# Altium schematic sheet sensors.SchDoc
size A4; Organization: Arribada Initiative; Address1: https://github.com/arribada; Address2: contact@arribada.org; Address3: arribada.org; Address4: UK - Portsmouth; DocumentNumber: 7; SheetNumber: 7; SheetTotal: 13
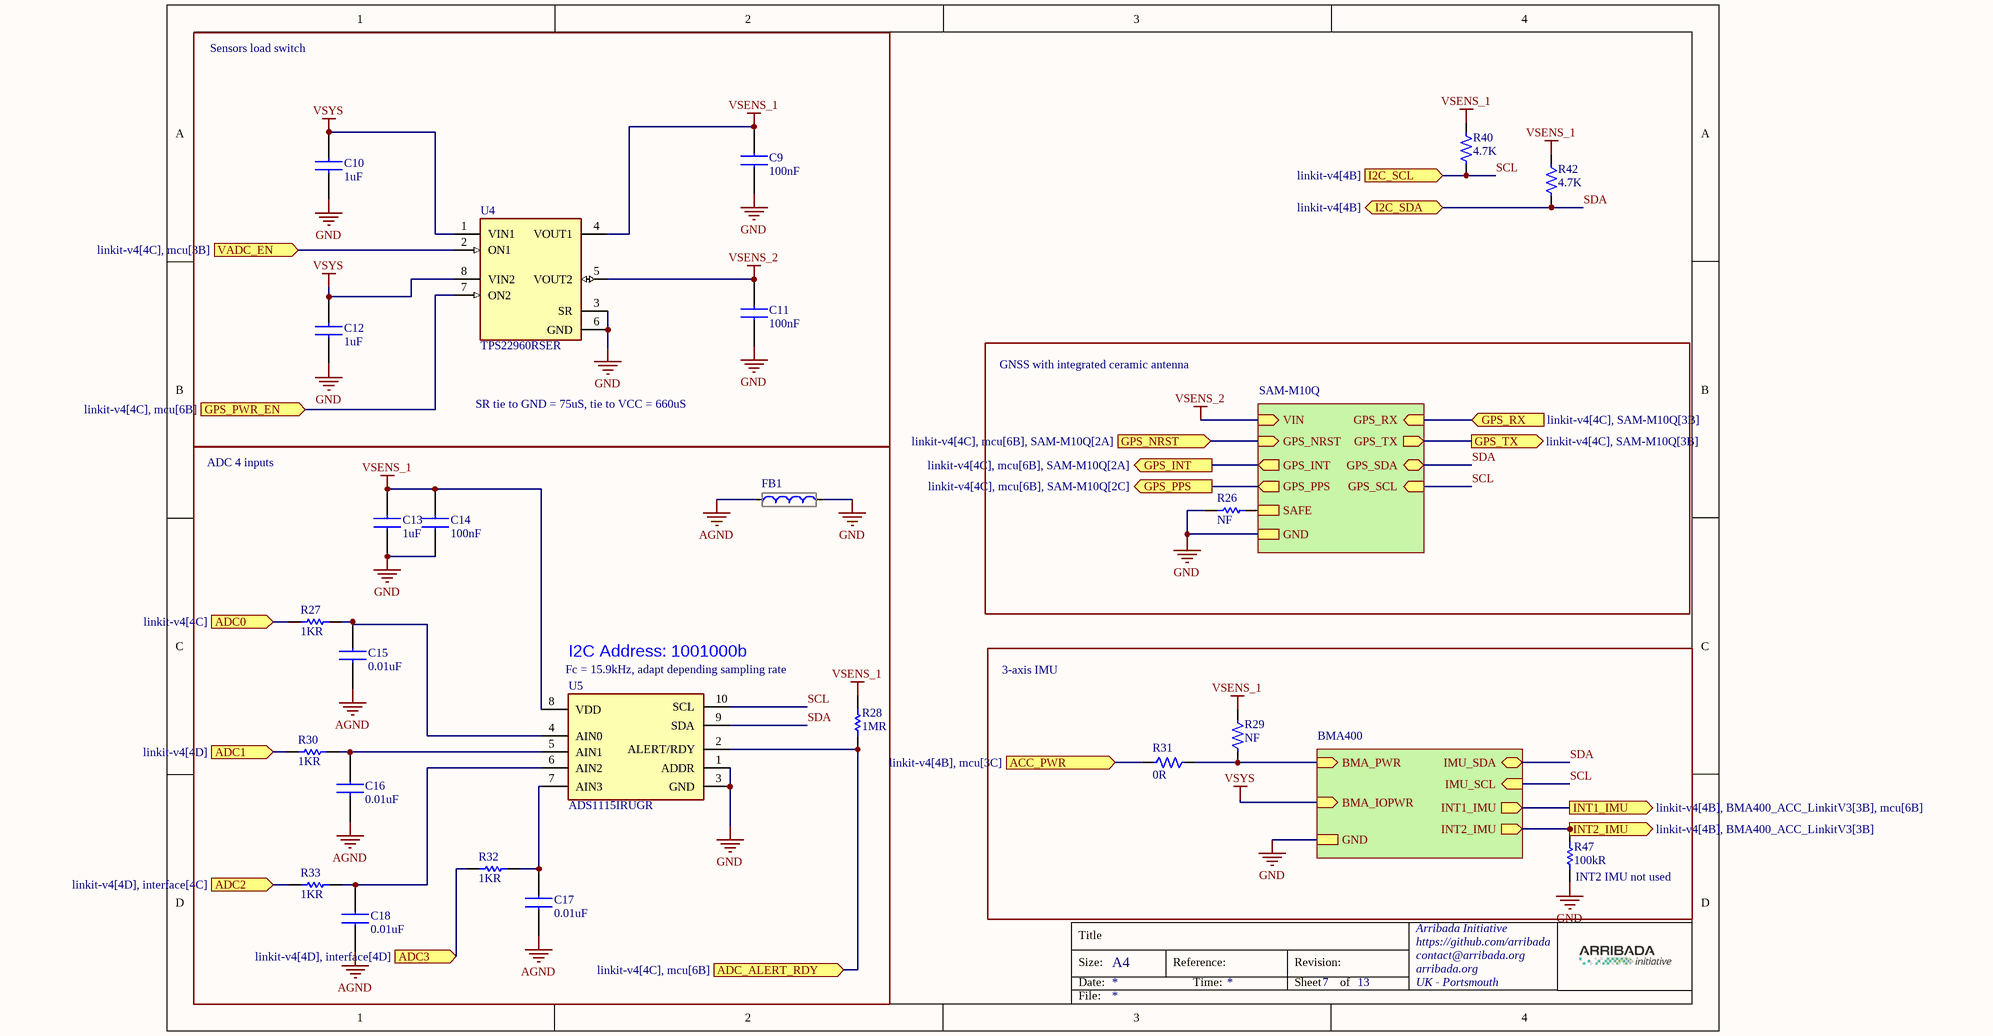
[diagram p0: sensors.SchDoc]

## Parts
C9  value 100nF  [0402]  (hidden comment: GRM155R71C104KA88D)
C10  1uF  [CAPC1005X55N]
C11  value 100nF  [0402]  (hidden comment: GRM155R71C104KA88D)
C12  1uF  [CAPC1005X55N]
C13  1uF  [CAPC1005X55N]
C14  value 100nF  [0402]  (hidden comment: GRM155R71C104KA88D)
C15  value 0.01uF  [GRM15x]  (hidden comment: GRM1555CYA103GE01D)
C16  value 0.01uF  [GRM15x]  (hidden comment: GRM1555CYA103GE01D)
C17  value 0.01uF  [GRM15x]  (hidden comment: GRM1555CYA103GE01D)
C18  value 0.01uF  [GRM15x]  (hidden comment: GRM1555CYA103GE01D)
FB1  BLM18HE601SN1D  [BLM18SP221SN1B]  (value not drawn)
R26  value NF  [R0402]  (hidden comment: Resistor)
R27  1kR  [RESC0603X28N]
R28  value 1MR  [RESC0603X26N]  (hidden comment: RC0201FR-7D1ML)
R29  value NF  [RES0402N_NF]  (hidden comment: RES NF 0402)
R30  1kR  [RESC0603X28N]
R31  value 0R  [RES0402N]  (hidden comment: 0R 0402)
R32  1kR  [RESC0603X28N]
R33  1kR  [RESC0603X28N]
R40  value 4.7K  [RES0201L]  (hidden comment: 4.7K 0201 1% 100PPM)
R42  value 4.7K  [RES0201L]  (hidden comment: 4.7K 0201 1% 100PPM)
R47  value 100kR  [RESC0603X28N]  (hidden comment: CRCW0201100KJNED)
U4  TPS22960RSER  [TPS22960RSER]
U5  ADS1115IRUGR  [ADS1115IRUGR]

## Blocks framed on the sheet
GNSS with integrated ceramic antenna: R26
I2C Address: 1001000b: C13-C18 FB1 R27 R28 R30 R32 R33 U5

## Sub-sheets
BMA400 = BMA400_ACC_LinkitV3: INT1_IMU (out), INT2_IMU (out), BMA_PWR (in), IMU_SDA (bidir), IMU_SCL (in), GND, BMA_IOPWR (in)
SAM-M10Q = SAM-M10Q: GPS_NRST (in), GPS_INT (out), GPS_SDA (bidir), GPS_PPS (out), VIN (in), GPS_TX (out), GPS_SCL (in), GPS_RX (in), GND, SAFE

## Ports
ACC_PWR (in, see linkit-v4[4B], mcu[3C]), ADC0 (in, see linkit-v4[4C]), ADC1 (in, see linkit-v4[4D]), ADC2 (in, see linkit-v4[4D], interface[4C]), ADC3 (in, see linkit-v4[4D], interface[4D]), ADC_ALERT_RDY (in, see linkit-v4[4C], mcu[6B]), GPS_INT (out, see linkit-v4[4C], mcu[6B], SAM-M10Q[2A]), GPS_NRST (in, see linkit-v4[4C], mcu[6B], SAM-M10Q[2A]), GPS_PPS (out, see linkit-v4[4C], mcu[6B], SAM-M10Q[2C]), GPS_PWR_EN (in, see linkit-v4[4C], mcu[6B]), GPS_RX (in, see linkit-v4[4C], SAM-M10Q[3B]), GPS_TX (out, see linkit-v4[4C], SAM-M10Q[3B]), I2C_SCL (in, see linkit-v4[4B]), I2C_SDA (bidir, see linkit-v4[4B]), INT1_IMU (out, see linkit-v4[4B], BMA400_ACC_LinkitV3[3B], mcu[6B]), INT2_IMU (out, see linkit-v4[4B], BMA400_ACC_LinkitV3[3B]), VADC_EN (in, see linkit-v4[4C], mcu[3B])

## Nets
AGND: C15.2 C16.2 C17.2 C18.2 FB1.1
GND: C9.2 C10.1 C11.2 C12.1 C13.1 C14.2 FB1.2 R26.1 R47.2 U4.3(SR) U4.6(GND) U5.1(ADDR) U5.3(GND) ; sheet SAM-M10Q/GND, sheet BMA400/GND
VSENS_1: C9.1 C13.2 C14.1 R28.1 R29.2 R40.2 R42.2 U4.4(VOUT1) U5.8(VDD)
VSENS_2: C11.1 U4.5(VOUT2) ; sheet SAM-M10Q/VIN
VSYS: C10.2 C12.2 U4.1(VIN1) U4.8(VIN2) ; sheet BMA400/BMA_IOPWR
ACC_PWR: R31.1 ; port ACC_PWR
ADC0: R27.1 ; port ADC0
ADC1: R30.1 ; port ADC1
ADC2: R33.1 ; port ADC2
ADC3: R32.1 ; port ADC3
ADC_ALERT_RDY: R28.2 U5.2(ALERT/RDY) ; port ADC_ALERT_RDY
GPS_INT: port GPS_INT, sheet SAM-M10Q/GPS_INT
GPS_NRST: port GPS_NRST, sheet SAM-M10Q/GPS_NRST
GPS_PPS: port GPS_PPS, sheet SAM-M10Q/GPS_PPS
GPS_PWR_EN: U4.7(ON2) ; port GPS_PWR_EN
GPS_RX: port GPS_RX, sheet SAM-M10Q/GPS_RX
GPS_TX: port GPS_TX, sheet SAM-M10Q/GPS_TX
INT1_IMU: port INT1_IMU, sheet BMA400/INT1_IMU
INT2_IMU: R47.1 ; port INT2_IMU, sheet BMA400/INT2_IMU
SCL: R40.1 U5.10(SCL) ; port I2C_SCL, sheet SAM-M10Q/GPS_SCL, sheet BMA400/IMU_SCL
SDA: R42.1 U5.9(SDA) ; port I2C_SDA, sheet SAM-M10Q/GPS_SDA, sheet BMA400/IMU_SDA
VADC_EN: U4.2(ON1) ; port VADC_EN
NetC15_1: C15.1 R27.2 U5.4(AIN0)
NetC16_1: C16.1 R30.2 U5.5(AIN1)
NetC17_1: C17.1 R32.2 U5.7(AIN3)
NetC18_1: C18.1 R33.2 U5.6(AIN2)
NetR26_2: R26.2 ; sheet SAM-M10Q/SAFE
NetR29_1: R29.1 R31.2 ; sheet BMA400/BMA_PWR

## Notes on the sheet
- Sensors load switch
- SR tie to GND = 75uS, tie to VCC = 660uS
- ADC 4 inputs
- Fc = 15.9kHz, adapt depending sampling rate
- 3-axis IMU
- (near R47) INT2 IMU not used
- Title
- Size:
- Date:
- A4
- Reference:
- Time:
- Revision:
- Sheet
- of
- File:

## Library data of the parts
C9 C11 C14 = GRM155R71C104KA88D: Multilayer Ceramic Capacitors MLCC - SMD/SMT 0.1 uF 16 VDC 10% 0402 X7R; Manufacturer_Part_Number: CC0402KRX7R7BB104; Manufacturer: YAGEO; Manufacturer 1: Murata; Description 1: 0402 0.1 uF 16V ±10 % Tolerance X7R SMT Multilayer Ceramic Capacitor; Voltage Rating: 16V; Package: C0402; Supplier 1: Mouser; Supplier Part Number 1: 81-GRM155R71C104KA88; Manufacturer Part Number 1: GRM155R71C104KA88D; RoHS 1: Yes; Category 1: Ceramic Capacitors; Stock 1: 7816691; Pricing 1: 1=0,1, 10=0,017, 50=0,017, 100=0,01, 1000=0,008, 10000=0,005 (USD); Mount: Surface Mount; Case/Package: 0402; Number of Pins: 2; Case Code (Metric): 1005; Case Code (Imperial): 0402; Material: Ceramic; Dielectric Material: Ceramic; Min Operating Temperature: -55°C; Max Operating Temperature: 125°C; Capacitance: 100nF; Tolerance: 10%; Packaging: Tape and Reel; Voltage Rating (DC): 16V; Package Quantity: 1; Dielectric: X7R; Termination: SMD/SMT; Voltage: 16V; Series: GRM; Length: 1mm; Width: 0.02inch; Height: 0.5mm; Thickness: 0.022inch; Depth: 0.5mm; Radiation Hardening: No; Lead Free: Lead Free; RoHS Compliant: Yes; Reach SVHC Compliant: Unknown; ComponentLink1URL: https://datasheet.ciiva.com/129/grm155r71c104ka88-01-129739.pdf?src-supplier=Digi-Key; ComponentLink1Description: https://datasheet.ciiva.com/129/grm155r71c104ka88-01-129739.pdf?src-supplier=Digi-Key; ComponentLink2URL: https://datasheet.ciiva.com/129/grm155r71c104ka88-01-129740.pdf?src-supplier=Digi-Key; ComponentLink2Description: https://datasheet.ciiva.com/129/grm155r71c104ka88-01-129740.pdf?src-supplier=Digi-Key; ComponentLink3URL: https://datasheet.ciiva.com/29199/454098-da-01-en-vs-kondensator-0402-29199799.pdf?src-supplier=Conrad; ComponentLink3Description: https://datasheet.ciiva.com/29199/454098-da-01-en-vs-kondensator-0402-29199799.pdf?src-supplier=Conrad; ComponentLink4URL: https://datasheet.ciiva.com/7937/4360-7937615.pdf?src-supplier=Element14; ComponentLink4Description: https://datasheet.ciiva.com/7937/4360-7937615.pdf?src-supplier=Element14; ComponentLink5URL: https://datasheet.ciiva.com/14116/grmseries-highdielectrictype-eng-14116878.pdf?src-supplier=Distrelec; ComponentLink5Description: https://datasheet.ciiva.com/14116/grmseries-highdielectrictype-eng-14116878.pdf?src-supplier=Distrelec; ComponentLink6URL: https://datasheet.ciiva.com/14103/grmseries-highdielectrictype-eng-14103750.pdf?src-supplier=Distrelec; ComponentLink6Description: https://datasheet.ciiva.com/14103/grmseries-highdielectrictype-eng-14103750.pdf?src-supplier=Distrelec; ComponentLink7URL: https://datasheet.ciiva.com/28534/4360-28534127.pdf?src-supplier=Element14; ComponentLink7Description: https://datasheet.ciiva.com/28534/4360-28534127.pdf?src-supplier=Element14; ComponentLink8URL: https://datasheet.ciiva.com/28534/4360-28534133.pdf?src-supplier=Element14; ComponentLink8Description: https://datasheet.ciiva.com/28534/4360-28534133.pdf?src-supplier=Element14
C10 C12 C13 = GRM155Z71A105KE01J: Multilayer Ceramic Capacitors MLCC - SMD/SMT 1.0UF 10V 10% 0402; Manufacturer_Name: Murata Electronics; Manufacturer 1: Murata; Description 1: Multi-Layer Ceramic Capacitor 1uF X7R 10% 0402 Paper T/R; Datasheet Link: http://www.murata.com/~/media/webrenewal/support/library/catalog/products/capacitor/mlcc/c02e.pdf; Height: 0.55mm; Manufacturer_Part_Number: GRM155Z71A105KE01J; Mouser Part Number: 81-GRM155Z71A105KE1J; Mouser Price/Stock: https://www.mouser.co.uk/ProductDetail/Murata-Electronics/GRM155Z71A105KE01J?qs=xZ%2FP%252Ba9zWqaF%2FmyRgV0iOA%3D%3D; Arrow Part Number: GRM155Z71A105KE01J; Arrow Price/Stock: https://www.arrow.com/en/products/grm155z71a105ke01j/murata-manufacturing?region=nac; Supplier 1: Mouser; Supplier Part Number 1: 81-GRM155Z71A105KE1J; Manufacturer Part Number 1: GRM155Z71A105KE01J; RoHS 1: Yes; Category 1: Ceramic Capacitors; Stock 1: 804340; Pricing 1: 1=0,1, 10=0,069, 50=0,069, 100=0,031, 1000=0,018, 10000=0,013 (USD); Supplier 2: Digi-Key; Supplier Part Number 2: 490-GRM155Z71A105KE01JCT-ND; Manufacturer 2: Murata; Manufacturer Part Number 2: GRM155Z71A105KE01J; RoHS 2: Yes; Description 2: Multi-Layer Ceramic Capacitor 1uF X7R 10% 0402 Paper T/R; Category 2: Ceramic Capacitors; Stock 2: 80025; Pricing 2: 1=0,1, 10=0,063, 50=0,0344, 100=0,0281, 500=0,02006, 1000=0,01577, 2500=0,01433, 5000=0,01319 (USD); Value: 1uF
C15-C18 = GRM1555CYA103GE01D: Multilayer Ceramic Capacitors MLCC - SMD/SMT 0.01 uF 35 VDC 2% 0402 C0G (NP0); Manufacturer_Name: Murata Electronics; Datasheet Link: https://search.murata.co.jp/Ceramy/image/img/A01X/G101/ENG/GRM1555CYA103GE01-01A.pdf; Height: 0.33mm; Manufacturer_Part_Number: GRM1555CYA103GE01D; Mouser Part Number: 81-GRM1555CYA103GE1D; Mouser Price/Stock: https://www.mouser.co.uk/ProductDetail/Murata-Electronics/GRM1555CYA103GE01D?qs=d0WKAl%252BL4Kaxz4NKPx2xBA%3D%3D
FB1 = BLM18HE601SN1D: Ferrite Beads 600 OHM 25%; Manufacturer_Name: Murata Electronics; Datasheet Link: http://www.murata.com/~/media/webrenewal/support/library/catalog/products/emc/emifil/c31e.ashx?la=en-gb; Height: 0.95mm; Manufacturer_Part_Number: BLM18HE601SN1D; Mouser Part Number: 81-BLM18HE601SN1D; Mouser Price/Stock: https://www.mouser.co.uk/ProductDetail/Murata-Electronics/BLM18HE601SN1D?qs=%2F%252BYoplLUB5hymM76VL7Sqw%3D%3D; Arrow Part Number: BLM18HE601SN1D; Arrow Price/Stock: https://www.arrow.com/en/products/blm18he601sn1d/murata-manufacturing?utm_currency=USD&region=nac
R26 = RES-NC-0402: Generic Resistor, Not Fitted; Internal_Part_Number: MCD-00052; Manufacturer_Part_Number: RC0402JR-070RL; Manufacturer: YAGEO; Provided_By: SUBCO; Initial_Board_Reference: MB1274; Status: Released; Part_Type: Resistor; Package: R0402; ComponentLink1Description: Datasheet; ComponentLink1URL: http://tunmcdsvn.tun.st.com/Component_Datasheet_Library/Trunk/Resistors/Yageo_Resistor_RC0402-series
R27 R30 R32 R33 = CRCW02011K00FNED: Thick Film Resistors - SMD 1/20watt 1Kohms 1% 200ppm; Manufacturer_Name: Vishay; Datasheet Link: http://www.vishay.com/docs/20035/dcrcwe3.pdf; Height: 0.28mm; Manufacturer_Part_Number: CRCW02011K00FNED; Mouser Part Number: 71-CRCW02011K00FNED; Mouser Price/Stock: https://www.mouser.co.uk/ProductDetail/Vishay-Dale/CRCW02011K00FNED?qs=IQLUlsvFoXtTp7ngtIXo7A%3D%3D; Arrow Part Number: CRCW02011K00FNED; Arrow Price/Stock: https://www.arrow.com/en/products/crcw02011k00fned/vishay?region=nac; Value: 1KR
R28 = RC0201FR-7D1ML: Thick Film Resistors - SMD 1 MOhms 50 mW 0201 1%; Manufacturer_Name: KEMET; Datasheet Link: http://www.yageo.com/documents/recent/PYu-RC0201_51_RoHS_L_8.pdf; Height: 0.26mm; Manufacturer_Part_Number: RC0201FR-7D1ML; Mouser Part Number: 603-RC0201FR-7D1ML; Mouser Price/Stock: https://www.mouser.co.uk/ProductDetail/YAGEO/RC0201FR-7D1ML?qs=NgbZBzc1CyEo5FlGf5N0Ug%3D%3D; Arrow Part Number: RC0201FR-7D1ML; Arrow Price/Stock: https://www.arrow.com/en/products/rc0201fr-7d1ml/yageo
R29 = RES NF 0402: Manufacturer: NOT FITTED PART; Manufacturers Part Number: NOT FITTED PART; Size: 0402; Supplier 1: Mouser; Supplier 2: Digi-Key
R31 = RES 0R 0402: Manufacturer: *; Manufacturers Part Number: *; Size: 0402; Supplier 1: Mouser; Supplier 2: Digi-Key; Supplier Part Number 1: 603-RC0402JR-070RL; Supplier Part Number 2: 311-0.0JRCT-ND
R40 R42 = RES 4.7K 0201 1% 100PPM: PPM: 100; Manufacturer: *; Manufacturers Part Number: *; Tolerance: 1%; Size: 0201; Supplier 1: Mouser; Supplier 2: Digi-Key; Supplier Part Number 1: 71-CRCW02014K70FKED; Supplier Part Number 2: 541-4.70KAABCT-ND
R47 = CRCW0201100KJNED: Thick Film Resistors - SMD 1/20watt 100Kohms 5% 200ppm; Manufacturer_Name: Vishay; Datasheet Link: http://www.vishay.com/docs/20035/dcrcwe3.pdf; Height: 0.28mm; Manufacturer_Part_Number: CRCW0201100KJNED; Mouser Part Number: 71-CRCW0201100KJNED; Mouser Price/Stock: https://www.mouser.co.uk/ProductDetail/Vishay-Dale/CRCW0201100KJNED?qs=IQLUlsvFoXu8A8gHIw6owA%3D%3D; Arrow Part Number: CRCW0201100KJNED; Arrow Price/Stock: https://www.arrow.com/en/products/crcw0201100kjned/vishay
U4 = TPS22960RSER: Power Switch ICs - Power Distribution Low Input VTG Dual L oad Switch; Manufacturer_Name: Texas Instruments; Datasheet Link: https://www.ti.com/lit/ds/symlink/tps22960.pdf?ts=1638681846865&ref_url=https%253A%252F%252Fwww.google.com%252F; Height: 0.6mm; Manufacturer_Part_Number: TPS22960RSER; Mouser Part Number: 595-TPS22960RSER; Mouser Price/Stock: https://www.mouser.co.uk/ProductDetail/Texas-Instruments/TPS22960RSER?qs=EQxOuqCyzqQpKHLEcq5RSg%3D%3D; Arrow Part Number: TPS22960RSER; Arrow Price/Stock: https://www.arrow.com/en/products/tps22960rser/texas-instruments?region=nac
U5 = ADS1115IRUGR: Analog to Digital Converters - ADC 16B ADC w/ Int MUX P GA Comp Osc & Ref A; Manufacturer_Name: Texas Instruments; Datasheet Link: https://www.ti.com/lit/ds/symlink/ads1115.pdf?ts=1601235703022&ref_url=https%253A%252F%252Fwww.ti.com%252Fproduct%252FADS1115%253FkeyMatch%253DADS1115IRUGR%2526tisearch%253DSearch-EN-everything%2526usecase%253DOPN; Height: 0.4mm; Manufacturer_Part_Number: ADS1115IRUGR; Mouser Part Number: 595-ADS1115IRUGR; Mouser Price/Stock: https://www.mouser.co.uk/ProductDetail/Texas-Instruments/ADS1115IRUGR?qs=IK5e5L0zOXhqw%2F8AHSSbuA%3D%3D; Arrow Part Number: ADS1115IRUGR; Arrow Price/Stock: https://www.arrow.com/en/products/ads1115irugr/texas-instruments?utm_currency=USD&region=nac